# EAGLE design MCU (EAGLE 9.5.2)
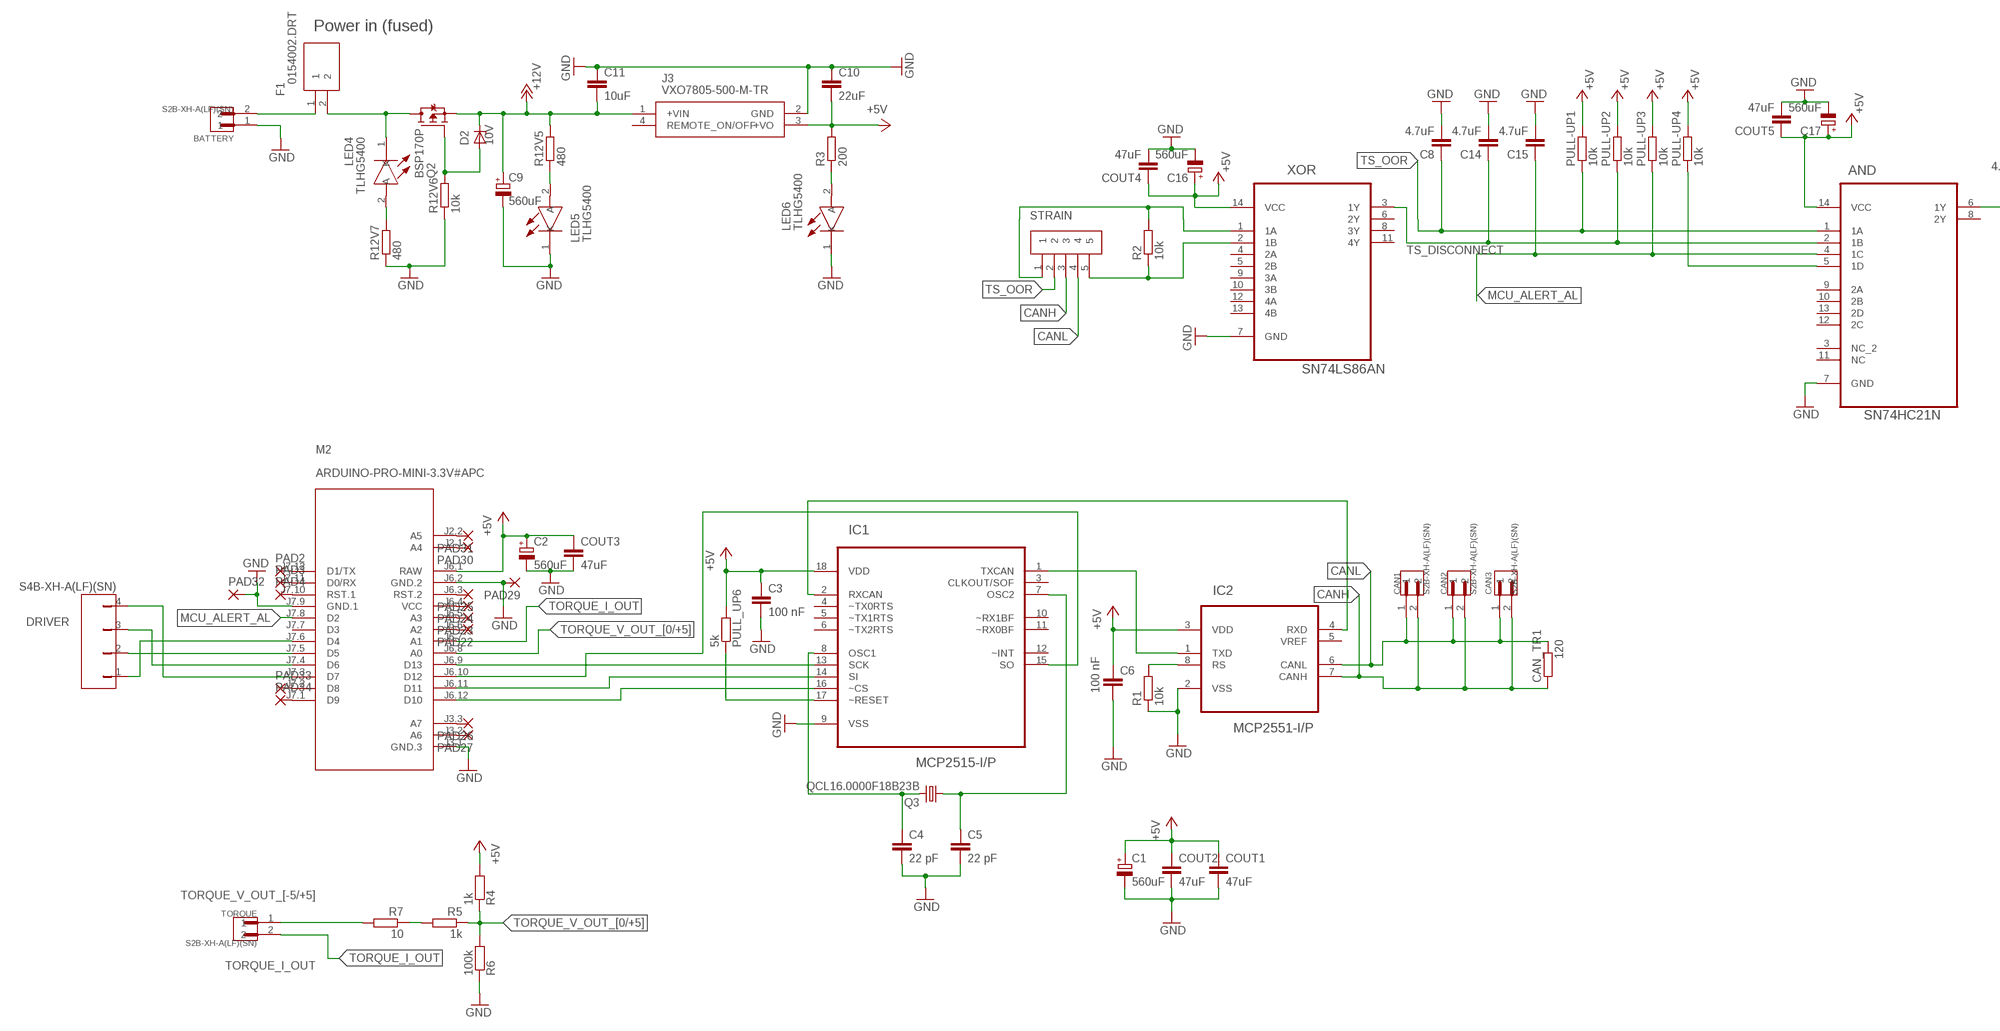
[diagram p0: schematic, sheet 1, part 1 of 2]
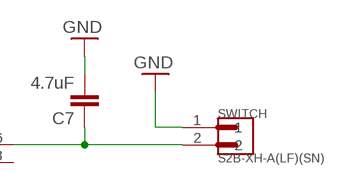
[diagram p1: schematic, sheet 1, part 2 of 2]

## Parts
AND  SN74HC21N  [DIP254P762X508-14]
BATTERY  S2B-XH-A(LF)(SN)  [JST_S2B-XH-A(LF)(SN)]
C1  560uF  CPOL-EUF  [PANASONIC_F]
C2  560uF  CPOL-EUF  [PANASONIC_F]
C3  100 nF  C-EUC0805  [C0805]
C4  22 pF  C-EUC0805  [C0805]
C5  22 pF  C-EUC0805  [C0805]
C6  100 nF  C-EUC0805  [C0805]
C7  4.7uF  C-EUC0805  [C0805]
C8  4.7uF  C-EUC0805  [C0805]
C9  560uF  CPOL-EUF  [PANASONIC_F]
C10  22uF  C-EUC0805  [C0805]
C11  10uF  C-EUC0805  [C0805]
C14  4.7uF  C-EUC0805  [C0805]
C15  4.7uF  C-EUC0805  [C0805]
C16  560uF  CPOL-EUF  [PANASONIC_F]
C17  560uF  CPOL-EUF  [PANASONIC_F]
CAN1  S2B-XH-A(LF)(SN)  [JST_S2B-XH-A(LF)(SN)]
CAN2  S2B-XH-A(LF)(SN)  [JST_S2B-XH-A(LF)(SN)]
CAN3  S2B-XH-A(LF)(SN)  [JST_S2B-XH-A(LF)(SN)]
CAN_TR1  120  R-EU_R0805  [R0805]
COUT1  47uF  C-EUC0805  [C0805]
COUT2  47uF  C-EUC0805  [C0805]
COUT3  47uF  C-EUC0805  [C0805]
COUT4  47uF  C-EUC0805  [C0805]
COUT5  47uF  C-EUC0805  [C0805]
D2  10V  ZENER-DIODESMB  [SMB]
DRIVER  S4B-XH-A(LF)(SN)  [S4B-XH-A(LF)(SN)]
F1  0154002.DRT  [FUSM9750X381N]
IC1  MCP2515-I/P  [DIP254P762X432-18]
IC2  MCP2551-I/P  [DIP254P762X432-8]
J3  VXO7805-500-M-TR  [VXO7805500MTR]
LED4  TLHG5400  [TLHG5400]
LED5  TLHG5400  [TLHG5400]
LED6  TLHG5400  [TLHG5400]
M2  ARDUINO-PRO-MINI-3.3V#APC  [ARDUINO-PRO-MINI#APC]
PAD2  SMD2  [SMD1,27-2,54]
PAD3  SMD2  [SMD1,27-2,54]
PAD4  SMD2  [SMD1,27-2,54]
PAD22  SMD2  [SMD1,27-2,54]
PAD23  SMD2  [SMD1,27-2,54]
PAD24  SMD2  [SMD1,27-2,54]
PAD25  SMD2  [SMD1,27-2,54]
PAD26  SMD2  [SMD1,27-2,54]
PAD27  SMD2  [SMD1,27-2,54]
PAD29  SMD2  [SMD1,27-2,54]
PAD30  SMD2  [SMD1,27-2,54]
PAD31  SMD2  [SMD1,27-2,54]
PAD32  SMD2  [SMD1,27-2,54]
PAD33  SMD2  [SMD1,27-2,54]
PAD34  SMD2  [SMD1,27-2,54]
PULL-UP1  10k  R-EU_R0805  [R0805]
PULL-UP2  10k  R-EU_R0805  [R0805]
PULL-UP3  10k  R-EU_R0805  [R0805]
PULL-UP4  10k  R-EU_R0805  [R0805]
PULL_UP6  5k  R-EU_R0805  [R0805]
Q2  BSP170P  [SOT223]
Q3  QCL16.0000F18B23B  CRYSTALHC49S  [HC49/S]
R1  10k  R-EU_R0805  [R0805]
R2  10k  R-EU_R0805  [R0805]
R3  200  R-EU_R0805  [R0805]
R4  1k  R-EU_R0805  [R0805]
R5  1k  R-EU_R0805  [R0805]
R6  100k  R-EU_R0805  [R0805]
R7  10  R-EU_R0805  [R0805]
R12V5  480  R-EU_R0805  [R0805]
R12V6  10k  R-EU_R0805  [R0805]
R12V7  480  R-EU_R0805  [R0805]
STRAIN  S5B-XH-A(LF)(SN)  [JST_S5B-XH-A(LF)(SN)]
SWITCH  S2B-XH-A(LF)(SN)  [JST_S2B-XH-A(LF)(SN)]
TORQUE  S2B-XH-A(LF)(SN)  [JST_S2B-XH-A(LF)(SN)]
XOR  SN74LS86AN  [DIP254P762X508-14]

## Nets
+5V: AND.14(VCC) C1.+ C2.+ C3.1 C6.1 C10.2 C16.+ C17.+ COUT1.1 COUT2.1 COUT3.1 COUT4.1 COUT5.1 IC1.18(VDD) IC2.3(VDD) J3.3(+VO) M2.J6.1(RAW) PULL-UP1.2 PULL-UP2.2 PULL-UP3.2 PULL-UP4.2 PULL_UP6.2 R3.2 R4.2 XOR.14(VCC)
+12V: C9.+ C11.2 D2.C J3.1(+VIN) Q2.3(S) R12V5.2
CANH: CAN1.2 CAN2.2 CAN3.2 CAN_TR1.1 IC2.7(CANH) STRAIN.3
CANL: CAN1.1 CAN2.1 CAN3.1 CAN_TR1.2 IC2.6(CANL) STRAIN.4
DRIVER_ALERT_AL: AND.5(1D) PULL-UP4.1
GND: AND.7(GND) BATTERY.1 C1.- C2.- C3.2 C4.2 C5.2 C6.2 C7.2 C8.2 C9.- C10.1 C11.1 C14.2 C15.2 C16.- C17.- COUT1.2 COUT2.2 COUT3.2 COUT4.2 COUT5.2 IC1.9(VSS) IC2.2(VSS) J3.2(GND) LED5.1(K) LED6.1(K) M2.J3.1(GND.3) M2.J6.2(GND.2) M2.J7.9(GND.1) PAD29.1(P) PAD32.1(P) R1.1 R6.1 R12V6.1 R12V7.1 SWITCH.1 XOR.7(GND)
MCU_ALERT_AL: AND.4(1C) C15.1 M2.J7.8(D2) PULL-UP3.1
N$1: LED4.2(A) R12V7.2
N$2: DRIVER.4 M2.J7.3(D7)
N$3: M2.J7.12(D1/TX) PAD2.1(P)
N$4: M2.J7.11(D0/RX) PAD3.1(P)
N$5: D2.A Q2.1(G) R12V6.2
N$6: BATTERY.2 F1.1
N$7: F1.2 LED4.1(K) Q2.2(D) Q2.4(D)
N$8: M2.J7.10(RST.1) PAD4.1(P)
N$9: DRIVER.1 M2.J7.6(D4)
N$10: M2.J6.6(A2) PAD22.1(P)
N$11: M2.J6.5(A3) PAD23.1(P)
N$12: M2.J6.4(VCC) PAD24.1(P)
N$13: IC1.15(SO) M2.J6.10(D12)
N$14: M2.J6.3(RST.2) PAD25.1(P)
N$15: DRIVER.2 M2.J7.5(D5)
N$16: R5.2 R7.1
N$17: M2.J3.3(A7) PAD26.1(P)
N$18: LED5.2(A) R12V5.1
N$19: LED6.2(A) R3.1
N$20: IC1.13(SCK) M2.J6.9(D13)
N$21: IC1.14(SI) M2.J6.11(D11)
N$22: IC1.16(~CS) M2.J6.12(D10)
N$23: DRIVER.3 M2.J7.4(D6)
N$40: M2.J3.2(A6) PAD27.1(P)
N$42: M2.J2.1(A4) PAD30.1(P)
N$49: M2.J2.2(A5) PAD31.1(P)
N$54: M2.J7.2(D8) PAD33.1(P)
N$55: M2.J7.1(D9) PAD34.1(P)
N$56: IC1.17(~RESET) PULL_UP6.1
N$58: C4.1 IC1.8(OSC1) Q3.2
N$59: C5.1 IC1.7(OSC2) Q3.1
N$60: IC2.8(RS) R1.2
N$62: IC1.2(RXCAN) IC2.4(RXD)
N$63: R2.2 STRAIN.1 XOR.1(1A)
N$64: AND.6(1Y) C7.1 SWITCH.2
N$67: R2.1 STRAIN.5 XOR.2(1B)
N$68: IC1.1(TXCAN) IC2.1(TXD)
TORQUE_I_OUT: M2.J6.7(A1) TORQUE.2
TORQUE_V_OUT_[0/+5]: M2.J6.8(A0) R4.1 R5.1 R6.2
TORQUE_V_OUT_[-5/+5]: R7.2 TORQUE.1
TS_DISCONNECT: AND.2(1B) C14.1 PULL-UP2.1 XOR.3(1Y)
TS_OOR: AND.1(1A) C8.1 PULL-UP1.1 STRAIN.2
Unconnected: AND.3(NC_2) AND.8(2Y) AND.9(2A) AND.10(2B) AND.11(NC) AND.12(2C) AND.13(2D) IC1.3(CLKOUT/SOF) IC1.4(~TX0RTS) IC1.5(~TX1RTS) IC1.6(~TX2RTS) IC1.10(~RX1BF) IC1.11(~RX0BF) IC1.12(~INT) IC2.5(VREF) J3.4(REMOTE_ON/OFF) M2.J7.7(D3) XOR.4(2A) XOR.5(2B) XOR.6(2Y) XOR.8(3Y) XOR.9(3A) XOR.10(3B) XOR.11(4Y) XOR.12(4A) XOR.13(4B)

## Notes on the sheet
- Power in (fused)

## Library data of the parts
AND = SN74HC21N:SN74HC21N: DUAL 4-IN POS AND GATES; AVAILABILITY: Unavailable; DESCRIPTION: AND Gate IC 2 Channel 14-PDIP; MF: Texas Instruments; MP: SN74HC21N; PACKAGE: DIP-14 Texas Instruments; PRICE: None
BATTERY CAN1-CAN3 SWITCH TORQUE = S2B-XH-A_LF__SN_:S2B-XH-A(LF)(SN): XH Series 2.5mm 2 Position Through Hole Shrouded Header Connector; DESCRIPTION: Connector Header Through Hole, Right Angle 2 position 0.098 _2.50mm_; DIGI-KEY_PART_NUMBER: 455-2257-ND; DIGI-KEY_PURCHASE_URL: https://www.digikey.com/product-detail/en/jst-sales-america-inc/S2B-XH-A_LF__SN_/455-2257-ND/1651055?utm_source=snapeda&utm_medium=aggregator&utm_campaign=symbol; MF: JST Sales; MP: S2B-XH-A_LF__SN_; PACKAGE: None
C1 C2 C9 C16 C17 = rcl:CPOL-EU: POLARIZED CAPACITOR, European symbol; SPICEPREFIX: C
C3-C8 C10 C11 C14 C15 COUT1-COUT5 = rcl:C-EU: CAPACITOR, European symbol; SPICEPREFIX: C
CAN_TR1 PULL-UP1-PULL-UP4 PULL_UP6 R1-R7 R12V5-R12V7 = rcl:R-EU_: RESISTOR, European symbol; SPICEPREFIX: R
D2 = diode:ZENER-DIODE: Z-Diode
DRIVER = S4B-XH-A_LF__SN_:S4B-XH-A(LF)(SN): http://octopart.com/s4b-xh-a%28lf%29%28sn%29-jst-7995347; AVAILABILITY: Unavailable; DESCRIPTION: Connector Header Through Hole, Right Angle 4 position 0.098 _2.50mm_; MF: JST Sales; MP: S4B-XH-A_LF__SN_; PACKAGE: None; PRICE: None
F1 = 0154002.DRT:0154002.DRT: Littelfuse 2A T Surface Mount Fuse, 125V ac/dc Source: Datasheet; DESCRIPTION: Littelfuse 2A T Surface Mount Fuse, 125V ac/dc; HEIGHT: 3.81mm; MANUFACTURER_NAME: LITTELFUSE; MANUFACTURER_PART_NUMBER: 0154002.DRT; MOUSER_PART_NUMBER: 576-0154002.DRT; MOUSER_PRICE-STOCK: https://www.mouser.co.uk/ProductDetail/Littelfuse/0154002DRT?qs=2VFNtWizgicDQ8R7JxIsmA%3D%3D
IC1 = MCP2515-I_P:MCP2515-I/P: Stand-Alone CAN Controller; AVAILABILITY: Unavailable; DESCRIPTION: MCP2515 Series 5.5 V 1 Mb/s Stand Alone SPI Interface CAN Controller - PDIP-18; MF: Microchip; MP: MCP2515-I/P; PACKAGE: DIP-18 Microchip; PRICE: None
IC2 = MCP2551-I_P:MCP2551-I/P: High-Speed CAN Transceiver; AVAILABILITY: Unavailable; DESCRIPTION: MCP2551 Series 5.5 V 1 Mb/s Surface Mount High-Speed CAN Transceiver - PDIP-8; MF: Microchip; MP: MCP2551-I/P; PACKAGE: DIP-8 Microchip; PRICE: None
J3 = VXO7805-500-M-TR:VXO7805-500-M-TR: Module DC-DC 24VIN 1-OUT 5V 0.5A 2.5W 4-Pin SMD Module T/R Source: Datasheet; DESCRIPTION: Module DC-DC 24VIN 1-OUT 5V 0.5A 2.5W 4-Pin SMD Module T/R; HEIGHT: 3.5mm; MANUFACTURER_NAME: CUI Inc; MANUFACTURER_PART_NUMBER: VXO7805-500-M-TR; MOUSER_PART_NUMBER: 490-VXO7805-500-M-TR; MOUSER_PRICE-STOCK: https://www.mouser.co.uk/ProductDetail/CUI-Inc/VXO7805-500-M-TR?qs=GBLSl2AkirsIOUn2Flq1hQ%3D%3D
LED4-LED6 = TLHG5400:TLHG5400: Vishay TLHG5400, 575 nm Green LED, 5mm (T-1 3/4) Round Through Hole package Source: Datasheet <https://componentsearchengine.com/Datasheets/1/TLHG5400.pdf>; DESCRIPTION: Vishay TLHG5400, 575 nm Green LED, 5mm (T-1 3/4) Round Through Hole package; HEIGHT: 9mm; MANUFACTURER_NAME: Vishay; MANUFACTURER_PART_NUMBER: TLHG5400; MOUSER_PART_NUMBER: 78-TLHG5400; MOUSER_PRICE-STOCK: https://www.mouser.com/Search/Refine.aspx?Keyword=78-TLHG5400
M2 = diy-modules:ARDUINO-PRO-MINI-*#APC: Arduino Pro Mini (and compatible devices) with angle programming connector More details available here: https://www.arduino.cc/en/Main/ArduinoBoardProMini Click here to find device on ebay.com <http://www.ebay.com/sch/arduino+pro+mini>
PAD2-PAD4 PAD22-PAD27 PAD29-PAD34 = wirepad:SMD2: SMD PAD
Q2 = transistor-fet:BSP170P: SIPMOS(R) Small-Signal-Transistor P-Channel, Enhancement mode Source: http://www.infineon.com/upload/Document/BSP170P_Rev2.4.pdf
Q3 = adafruit:CRYSTAL: CRYSTAL; OC_FARNELL: 1667008; OC_NEWARK: unknown
STRAIN = S5B-XH-A_LF__SN_:S5B-XH-A(LF)(SN): XH Connector 2.5mm pitch/Disconnectable Crimp Style Connector; AVAILABILITY: Unavailable; DESCRIPTION: Connector Header Through Hole, Right Angle 5 position 0.098 _2.50mm_; MF: JST Sales; MP: S5B-XH-A_LF__SN_; PACKAGE: None; PRICE: None
XOR = SN74LS86AN:SN74LS86AN: QUADRUPLE 2-INPUT EXCLUSIVE-OR GATES; AVAILABILITY: Unavailable; DESCRIPTION: XOR _Exclusive OR_ IC 4 Channel 14-SOP; MF: Texas Instruments; MP: SN74LS86AN; PACKAGE: DIP-14 Texas Instruments; PRICE: None

## Net classes
1 signal: width 0.3 mm, drill 0.4 mm, clearance 0.25 mm
2 12V: width 1 mm, drill 1.1 mm, clearance 0.25 mm

## Board
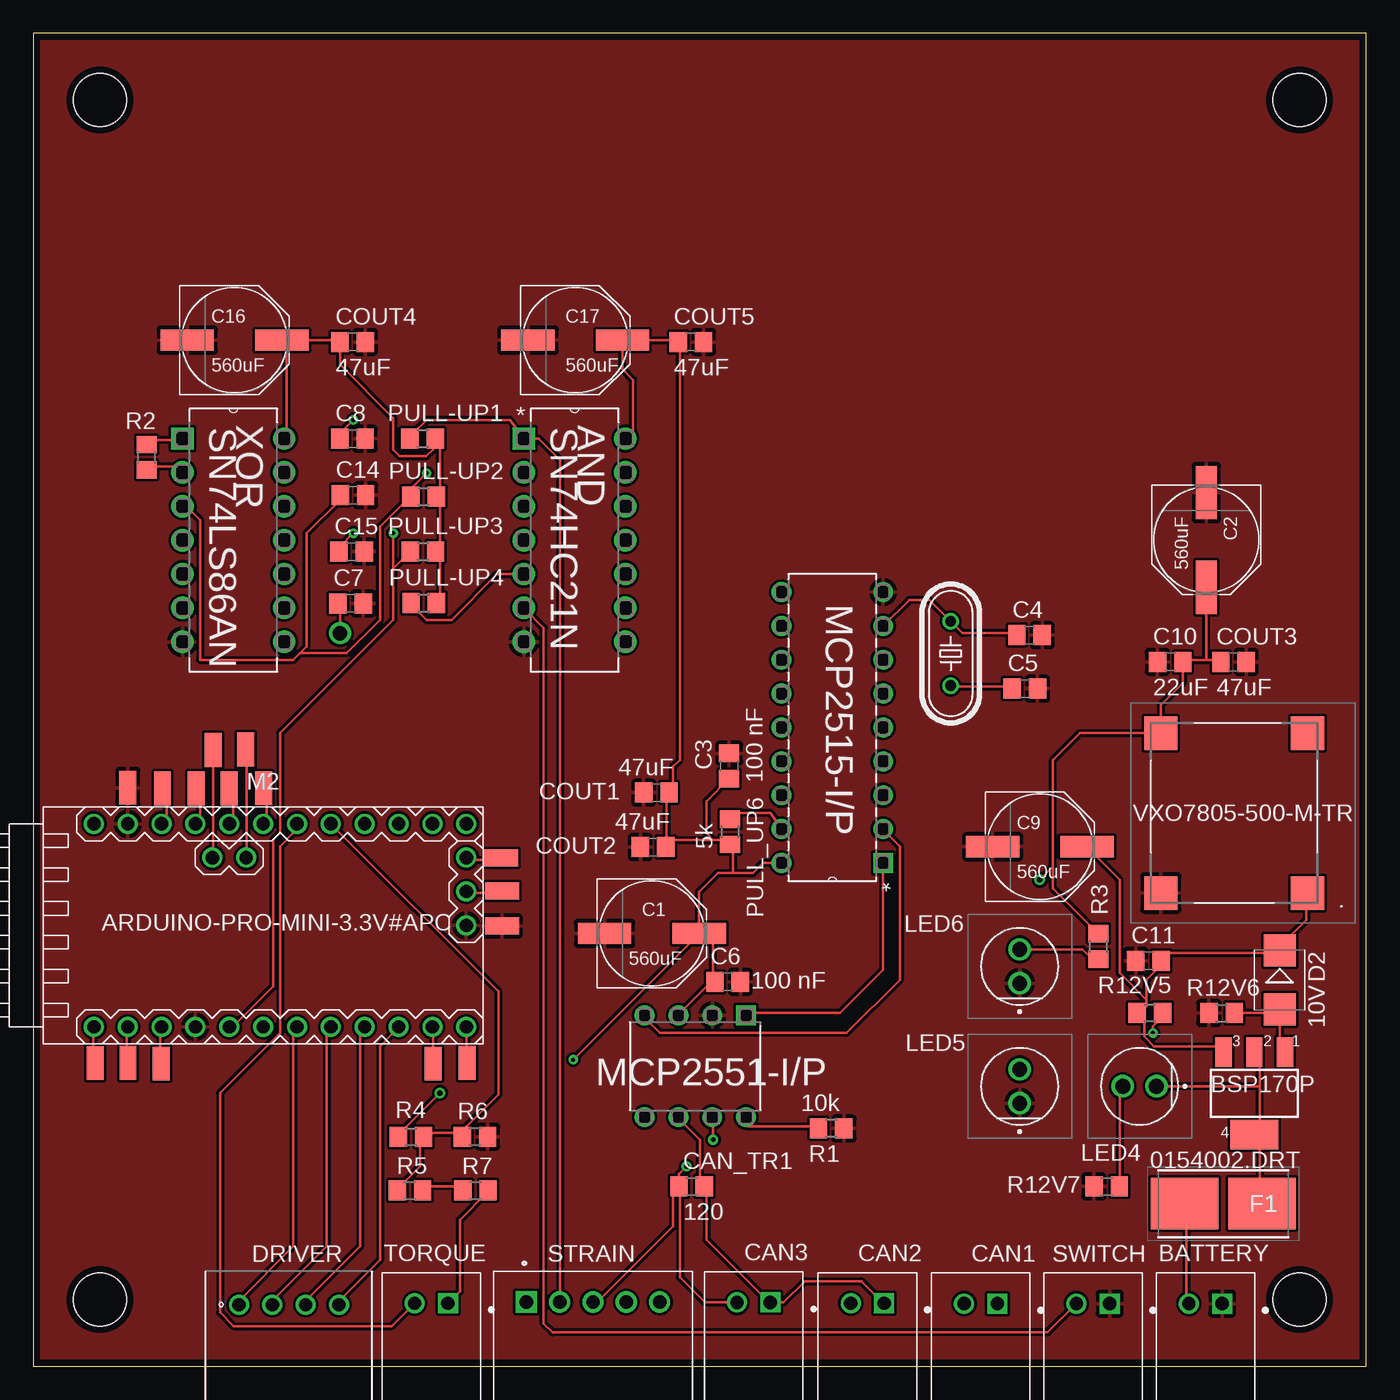
[diagram p2: board, top side]
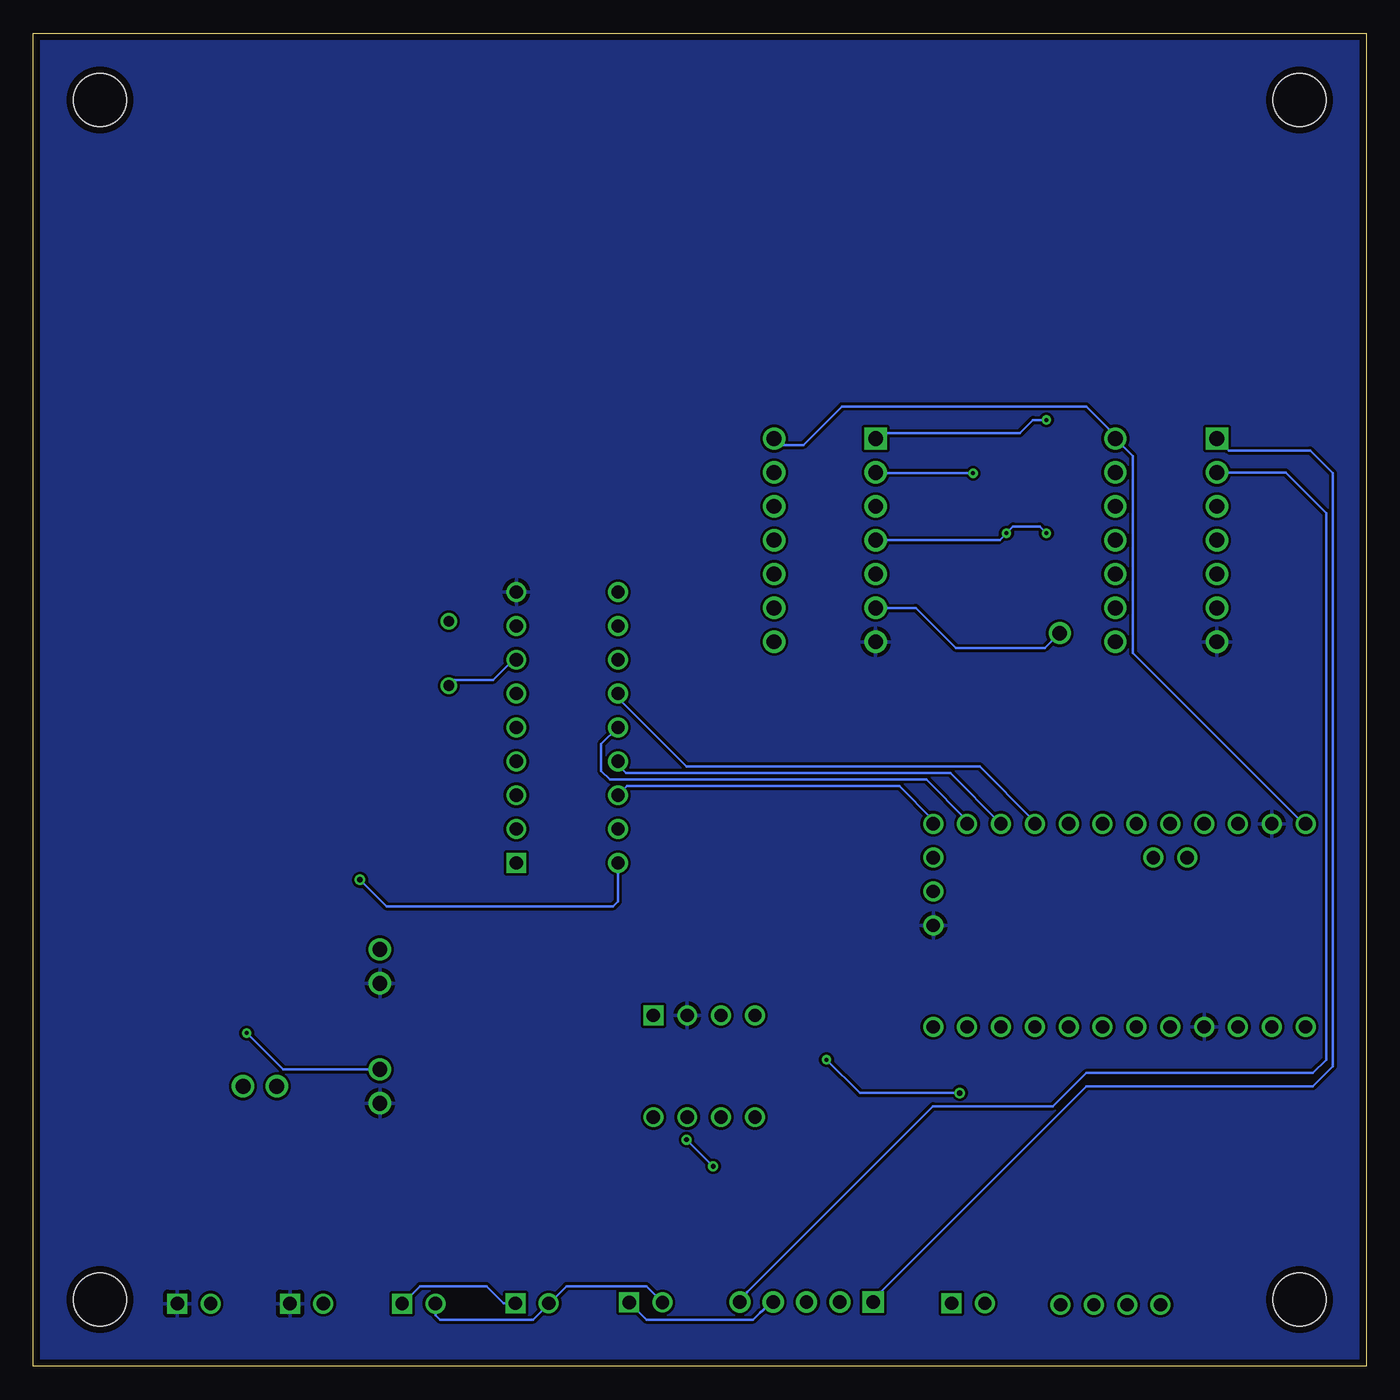
[diagram p3: board, bottom side, seen from below]

Size 100 x 100 mm. Coordinates in mm from the lower left corner, seen from the top.
Outline: 0,0 100,0 100,100 0,100 0,0
Copper layers (1*16): Top 0.035mm / dielectric 1.5mm / Bottom 0.035mm
Design rules "JLC_Vermilion2020": minimum track width 0.2mm, minimum drill 0.3mm, track to track 0.2mm, track to pad 0.3mm, pad to pad 0.3mm, via to via 0.2mm, smd to smd 0.2mm, copper to edge 0.5mm, drill to drill 0.25mm, minimum pad ring 0.2mm, minimum via ring 0.2mm, stop-mask expansion 0.055mm, vias tented up to drill 0.3mm, thermal gap 0.3mm
Holes 4 mm at 5,95 5,5 95,5 95,95

### Footprints (pad centres in the part's own frame; a part is rotated, then mirrored left to right if it is on the bottom)
DIP254P762X508-14 = drill 1.118 square: 1 -7.62,15.24 | drill 1.118: 2 -7.62,12.7; 3 -7.62,10.16; 4 -7.62,7.62; 5 -7.62,5.08; 6 -7.62,2.54; 7 -7.62,0; 8 0,0; 9 0,2.54; 10 0,5.08; 11 0,7.62; 12 0,10.16; 13 0,12.7; 14 0,15.24
JST_S2B-XH-A(LF)(SN) = drill 1 square: 1 -1.25,0 | drill 1: 2 1.25,0
PANASONIC_F = smd 4 x 1.6: + 3.55,0; - -3.55,0
C0805 = smd 1.3 x 1.5: 1 -0.95,0; 2 0.95,0
R0805 = smd 1.3 x 1.5: 1 -0.95,0; 2 0.95,0
SMB = smd 2.4 x 2.4: A 2.2,0; C -2.2,0
S4B-XH-A(LF)(SN) = drill 1: 1 -0.02,3.75; 2 -0.02,1.25; 3 -0.02,-1.25; 4 -0.02,-3.75
FUSM9750X381N = smd 5.05 x 3.85: 1 -2.9,0; 2 2.9,0
DIP254P762X432-18 = drill 0.991 square: 1 -7.62,20.32 | drill 0.991: 2 -7.62,17.78; 3 -7.62,15.24; 4 -7.62,12.7; 5 -7.62,10.16; 6 -7.62,7.62; 7 -7.62,5.08; 8 -7.62,2.54; 9 -7.62,0; 10 0,0; 11 0,2.54; 12 0,5.08; 13 0,7.62; 14 0,10.16; 15 0,12.7; 16 0,15.24; 17 0,17.78; 18 0,20.32
DIP254P762X432-8 = drill 0.991 square: 1 -7.62,7.62 | drill 0.991: 2 -7.62,5.08; 3 -7.62,2.54; 4 -7.62,0; 5 0,0; 6 0,2.54; 7 0,5.08; 8 0,7.62
VXO7805500MTR = smd 2.5 x 2.5: 1 -5.5,6; 2 5.5,6; 3 5.5,-6; 4 -5.5,-6
TLHG5400 = drill 1.12 pad 1.68: 1 1.27,0; 2 -1.27,0
ARDUINO-PRO-MINI#APC = drill 1: J2.1 -1.27,5.08; J2.2 -3.81,5.08; J3.1 15.24,0; J3.2 15.24,2.54; J3.3 15.24,5.08; J6.1 -12.7,7.62; J6.2 -10.16,7.62; J6.3 -7.62,7.62; J6.4 -5.08,7.62; J6.5 -2.54,7.62; J6.6 0,7.62; J6.7 2.54,7.62; J6.8 5.08,7.62; J6.9 7.62,7.62; J6.10 10.16,7.62; J6.11 12.7,7.62; J6.12 15.24,7.62; J7.1 15.24,-7.62; J7.2 12.7,-7.62; J7.3 10.16,-7.62; J7.4 7.62,-7.62; J7.5 5.08,-7.62; J7.6 2.54,-7.62; J7.7 0,-7.62; J7.8 -2.54,-7.62; J7.9 -5.08,-7.62; J7.10 -7.62,-7.62; J7.11 -10.16,-7.62; J7.12 -12.7,-7.62
SMD1,27-2,54 = smd 1.27 x 2.54: 1 0,0
SOT223 = smd 1.219 x 2.235: 1 -2.311,-3.099; 2 0,-3.099; 3 2.311,-3.099 | smd 3.6 x 2.2: 4 0,3.099
HC49/S = drill 0.813: 1 -2.413,0; 2 2.413,0
JST_S5B-XH-A(LF)(SN) = drill 1 pad 1.59 square: 1 -5,0 | drill 1 pad 1.59: 2 -2.5,0; 3 0,0; 4 2.5,0; 5 5,0

### Placement (x,y rotation side)
AND  44.42,54.35 0 top
BATTERY  87.94,4.69 180 top
C1  46.4,32.47 0 top
C2  88,62 270 top
C3  52.2,45.04 90 top
C4  74.74,54.84 0 top
C5  74.39,50.84 0 top
C6  52.09,28.84 0 top
C7  23.8,57.24 0 top
C8  23.94,69.59 0 top
C9  75.52,38.98 0 top
C10  85.29,52.84 0 top
C11  83.66,30.42 0 top
C14  23.98,65.35 0 top
C15  23.88,61.11 0 top
C16  15.09,76.98 0 top
C17  40.66,76.98 0 top
CAN1  71.08,4.69 180 top
CAN2  62.58,4.72 180 top
CAN3  54.04,4.79 180 top
CAN_TR1  49.39,13.49 0 top
COUT1  46.74,43.03 180 top
COUT2  46.49,38.95 180 top
COUT3  90.04,52.83 0 top
COUT4  23.95,76.84 0 top
COUT5  49.33,76.84 0 top
D2  93.5,28.98 270 top
DRIVER  19.18,4.62 90 top
F1  89.28,12.19 0 top
IC1  56.14,58.08 180 top
IC2  45.86,18.69 270 top
J3  90.09,41.5 180 top
LED4  83,21 0 top
LED5  74,21 270 top
LED6  74,30 270 top
M2  17.24,33.07 0 top
PAD2  4.63,22.74 180 top
PAD3  7.1,22.75 180 top
PAD4  9.58,22.7 180 top
PAD22  17.27,43.37 180 top
PAD23  14.69,43.34 180 top
PAD24  12.21,43.35 180 top
PAD25  9.69,43.35 180 top
PAD26  35.1,38.15 270 top
PAD27  35.16,35.65 270 top
PAD29  7.08,43.4 180 top
PAD30  15.93,46.26 180 top
PAD31  13.48,46.24 180 top
PAD32  35.17,33.02 270 top
PAD33  30.01,22.7 180 top
PAD34  32.53,22.77 180 top
PULL-UP1  29.21,69.6 0 top
PULL-UP2  29.28,65.25 0 top
PULL-UP3  29.23,61.12 0 top
PULL-UP4  29.3,57.27 0 top
PULL_UP6  52.26,40.09 270 top
Q2  91.61,20.47 180 top
Q3  68.83,53.47 90 top
R1  59.86,17.84 180 top
R2  8.49,68.19 90 top
R3  79.91,31.49 90 top
R4  28.33,17.19 180 top
R5  28.25,13.19 0 top
R6  33.13,17.22 180 top
R7  33.17,13.19 0 top
R12V5  83.77,26.49 180 top
R12V6  89.15,26.49 0 top
R12V7  80.53,13.49 0 top
STRAIN  41.99,4.82 0 top
SWITCH  79.5,4.69 180 top
TORQUE  29.85,4.72 180 top
XOR  18.82,54.35 0 top

### Tracks (layer width: path | path; a pad name or v marks a point on that pad's centre or on a via)
+5V  (via drill 0.3, 0.4)
  Top 0.2: PULL-UP4.2 30.5,57.5 30.5,61 PULL-UP3.2 30.5,61.5 30.5,65 PULL-UP2.2 30.5,65.5 30.5,69.5 PULL-UP1.2 30,69.44 30,68.78 29.48,68.27 27.49,68.27 27,68.76 27,71.14 23,75.14 COUT4.1 23,77 19,77 C16.+ 19,76.5 19,70 XOR.14 | AND.14 45,70.17 45,74 44.21,74.79 C17.+ 44.5,77 48,77 COUT5.1 48.5,76.72 48.5,45.5 48,45 48,43.5 COUT1.1 47.5,43 47.5,39 COUT2.1 47.51,39.5 51,39.5 | 76.5,37.5 76.5,45.5 78.5,47.5 J3.3 84.59,49.59 86.24,51.24 C10.2 86.5,53 88,53 | 88,53 89,53 COUT3.1 | 88,53 C2.+ | 51,39.5 52,39.5 PULL_UP6.2 52.5,39 52.5,37 | C3.1 50.5,42.38 50.5,40 51,39.5 | C1.+ 49.95,35.6 51.35,37 52.5,37 | v30.5,20.5 27.5,17.5 R4.2 | 51,29 51,32.36 C1.+ | v75.5,36.5 76.5,37.5 | R3.2 76.5,35.85 76.5,37.5 | 52.5,37 54,37 54.76,37.76 IC1.18 | 51,29 48.5,26.5 IC2.3 | 51,29 C6.1 | v40.5,23 49.5,32 C1.+
  Bottom 0.2: M2.J6.1 5,41 17.5,53.5 17.5,68.27 XOR.14 19,70 21,72 39.33,72 42.22,69.11 43.94,69.11 AND.14 | v30.5,20.5 38,20.5 v40.5,23 | v75.5,36.5 73.5,34.5 56.5,34.5 56.14,34.86 IC1.18
+12V
  Top 0.2: J3.1 95.5,35.5 95.5,33.5 93.5,31.5 D2.C 93.5,31 85,31 85,30.5 C11.2 84.5,30 83.5,29 83.5,27.5 | 83.5,27.5 83.5,27 83,26.5 R12V5.2 83.35,25.96 83.35,24.73 84.08,24 89,24 Q2.3 | 83.5,27.5 81.5,29.5 81.5,36.5 79.5,38.5 C9.+
CANH  (via drill 0.35)
  Top 0.2: CAN3.2 50.38,4.79 48.5,6.66 48.5,13 CAN_TR1.1 | CAN_TR1.1 48,13 48,10.5 42.31,4.82 STRAIN.3 | CAN_TR1.1 48.44,14.44 v49,15 | v51,17 51,18.63 IC2.7
  Bottom 0.2: CAN1.2 69.83,3.83 69.5,3.5 62.5,3.5 61.5,4.5 CAN2.2 61,5 60,6 54,6 53,5 CAN3.2 | v49,15 v51,17
CANL
  Top 0.2: CAN2.1 63.5,5 62.12,6.38 57.89,6.38 56.29,4.79 CAN3.1 55,5 50.5,9.5 50.5,13 CAN_TR1.2 50,13.5 50,17 48.4,18.6 IC2.6
  Bottom 0.2: CAN2.1 64.72,4.72 66,6 71,6 72,5 CAN1.1 | STRAIN.4 45.49,4.01 46,3.5 54,3.5 55,4.5 CAN3.1
DRIVER_ALERT_AL
  Top 0.2: PULL-UP4.1 28.5,57 29.5,56 31.37,56 34.8,59.43 AND.5
GND
  pour Top: -1,105 -6,100 -6,-10 109,-10 109,98 102,105
  pour Bottom: -1,106 -8,99 -8,-6 -1,-13 109,-13 110,-12 110,104 1,104
MCU_ALERT_AL  (via drill 0.3)
  Top 0.2: v24,62.5 23,61.5 C15.1 | PULL-UP3.1 27,59.84 v27,62.5 27,56 18.5,47.5 18.5,40 18,39.5 18,28.5 15,25.5 M2.J7.8
  Bottom 0.2: v24,62.5 24.5,63 26.5,63 v27,62.5 27.5,62 36.5,62 AND.4
N$1
  Top 0.2: R12V7.2 81.5,13.5 81.5,21 LED4.2
N$2
  Top 0.2: DRIVER.4 23,5 26,8 26,24 27,25 M2.J7.3
N$3
  Top 0.2: PAD2.1 4.5,23 4.5,25 M2.J7.12
N$4
  Top 0.2: PAD3.1 7,23 7,25 M2.J7.11
N$5
  Top 0.2: 93.5,26.5 90.5,26.5 R12V6.2 | 93.5,26.5 93.5,24 Q2.1 | 93.5,26.5 D2.A
N$6
  Top 0.2: BATTERY.2 86.5,5 86.5,12 F1.1
N$7
  Top 0.2: 92,21 92,17.5 Q2.4 92,17 92,12.5 F1.2 | 92,21 92,23.5 Q2.2 | 92,21 LED4.1
N$8
  Top 0.2: PAD4.1 9.5,23 9.5,25 M2.J7.10
N$9
  Top 0.2: DRIVER.1 15.5,5 19.5,9 19.5,25 M2.J7.6
N$10
  Top 0.2: PAD22.1 17.5,43 17.5,41 M2.J6.6
N$11
  Top 0.2: PAD23.1 15,43 15,41 M2.J6.5
N$12
  Top 0.2: PAD24.1 12.5,43 12.5,41 M2.J6.4
N$13
  Bottom 0.2: M2.J6.10 31.21,44.5 55.51,44.5 56.14,45.13 IC1.15
N$14
  Top 0.2: PAD25.1 10,43 10,41 M2.J6.3
N$15
  Top 0.2: DRIVER.2 18,5 22,9 22,25 M2.J7.5
N$16
  Top 0.2: R5.2 29.5,13.5 32,13.5 R7.1
N$17
  Top 0.2: PAD26.1 35,38 32.5,38 M2.J3.3
N$18  (via drill 0.3)
  Top 0.2: v84,25 84,25.5 84.5,26 R12V5.1
  Bottom 0.2: LED5.2 81.27,22.27 v84,25
N$19
  Top 0.2: LED6.2 78.71,31.27 79.44,30.54 R3.1
N$20
  Bottom 0.2: IC1.13 56,50 51,45 29,45 25,41 M2.J6.9
N$21
  Bottom 0.2: IC1.14 57.39,46.67 57.39,44.67 56.73,44.01 33.01,44.01 30,41 M2.J6.11
N$22
  Bottom 0.2: IC1.16 55.46,43.52 35.02,43.52 32.5,41 M2.J6.12
N$23
  Top 0.2: DRIVER.3 20.5,5 24.5,9 24.5,25 M2.J7.4
N$40
  Top 0.2: PAD27.1 35,35.5 32.5,35.5 M2.J3.2
N$42
  Top 0.2: PAD30.1 16,46 16,38.5 M2.J2.1
N$49
  Top 0.2: PAD31.1 13.5,46 13.5,38.5 M2.J2.2
N$54
  Top 0.2: PAD33.1 30,23 30,25 M2.J7.2
N$55
  Top 0.2: PAD34.1 32.5,23 32.5,25 M2.J7.1
N$56
  Top 0.2: PULL_UP6.1 52.72,41.5 55.3,41.5 IC1.17
N$58
  Top 0.2: C4.1 73.5,55 69.71,55 Q3.2 67.21,57.5 65.72,57.5 IC1.8
N$59
  Top 0.2: C5.1 73,51 69,51 Q3.1
  Bottom 0.2: IC1.7 64,53 65.5,51.5 68.5,51.5 Q3.1
N$60
  Top 0.2: R1.2 58.5,18 53.5,18 53.5,18.5 IC2.8
N$62
  Top 0.2: IC2.4 46,26 47,25 61,25 65,29 65,39 64,40 IC1.2
N$63
  Top 0.2: R2.2 8.5,69.5 11,69.5 XOR.1
  Bottom 0.2: STRAIN.1 36.41,5.59 21,21 4,21 2.5,22.5 2.5,67 4.2,68.69 10.3,68.69 XOR.1
N$64  (via drill 1.1)
  Top 0.2: SWITCH.2 76.1,2.54 38.95,2.54 38.29,3.2 38.29,55.4 AND.6 | C7.1 23,57.09 v23,55
  Bottom 0.2: v23,55 24.11,53.89 30.8,53.89 33.8,56.89 AND.6
N$67
  Top 0.2: R2.1 8.5,67.5 11,67.5 XOR.2
  Bottom 0.2: STRAIN.5 46.41,5.59 32.5,19.5 23.5,19.5 21,22 4,22 3,23 3,64 6.05,67.05 XOR.2
N$68
  Top 0.2: IC1.1 63.74,37.74 63.74,29.74 60.5,26.5 53.5,26.5 IC2.1
TORQUE_I_OUT
  Top 0.2: M2.J6.7 19.5,40.5 19.5,40 18.5,39 18.5,25 14,20.5 14,4.03 15.03,3 26.88,3 TORQUE.2
TORQUE_V_OUT_[0/+5]
  Top 0.2: R5.1 27.5,13.5 29,15 29,17 R4.1 29.5,17.5 32,17.5 R6.2 32.5,17.5 32.5,18 34.89,20.39 34.89,28.11 22.5,40.5 M2.J6.8
TORQUE_V_OUT_[-5/+5]
  Top 0.2: R7.2 34,13 32,11 32,5.62 TORQUE.1
TS_DISCONNECT  (via drill 0.3)
  Top 0.2: 20,53.5 19.5,53 12.5,53 12.5,63.5 11.5,64.5 XOR.3 | 20,53.5 20.5,54 20.5,62.5 23,65 C14.1 | 20,53.5 23.5,53.5 26,56 26,63 28,65 PULL-UP2.1 28.5,65.5 28.5,66 v29.5,67
  Bottom 0.2: v29.5,67 36.5,67 AND.2
TS_OOR  (via drill 0.3)
  Top 0.2: v24,71 23,70 C8.1 | PULL-UP1.1 28.5,70 29.5,71 35.77,71 AND.1 37.91,69.59 39.5,68 STRAIN.2
  Bottom 0.2: v24,71 25,71 26,70 36.5,70 AND.1